# EAGLE schematic Master10 (EAGLE 6.2)
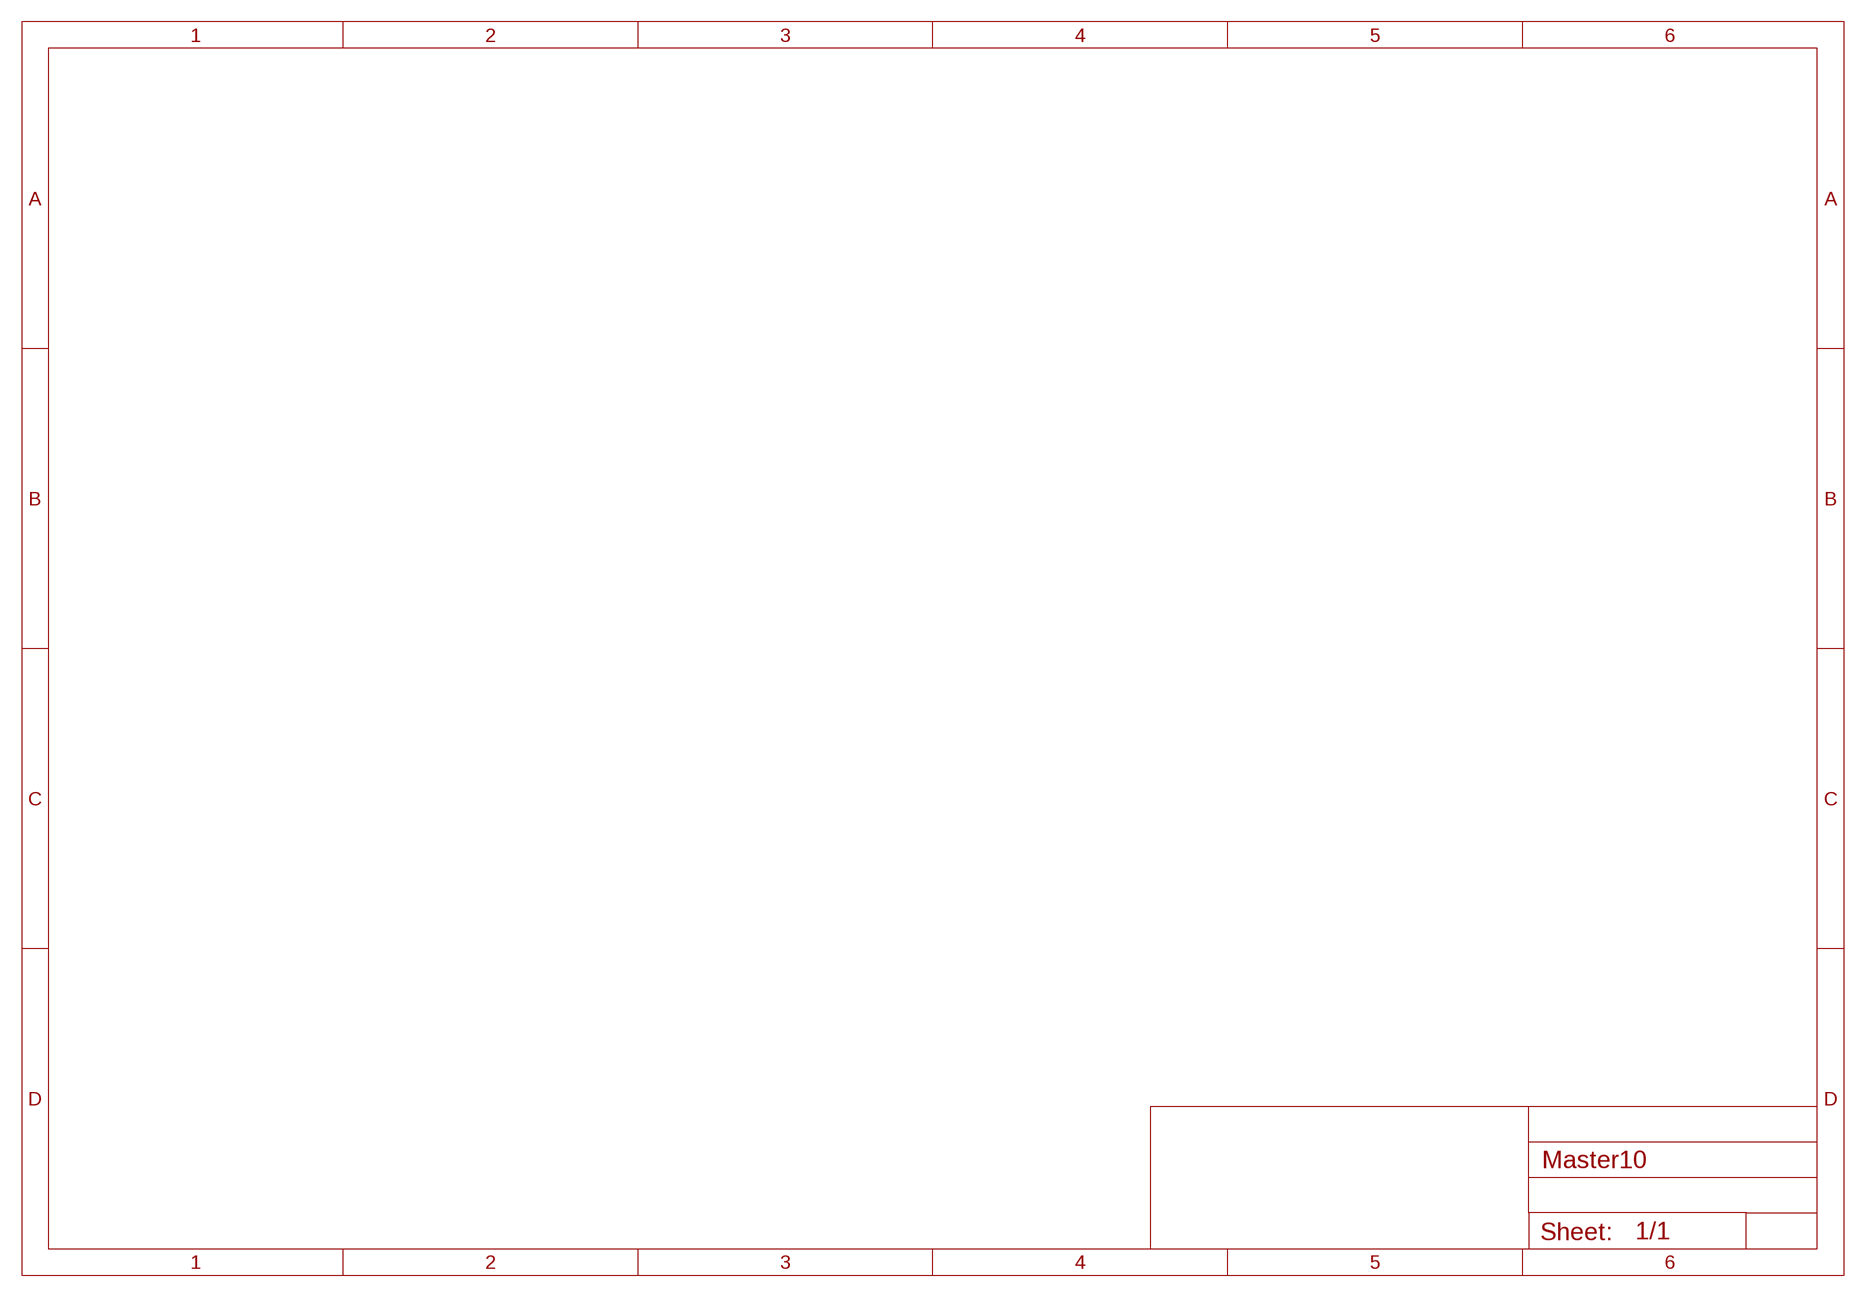
[diagram p0: schematic, sheet 1, part 1 of 2]
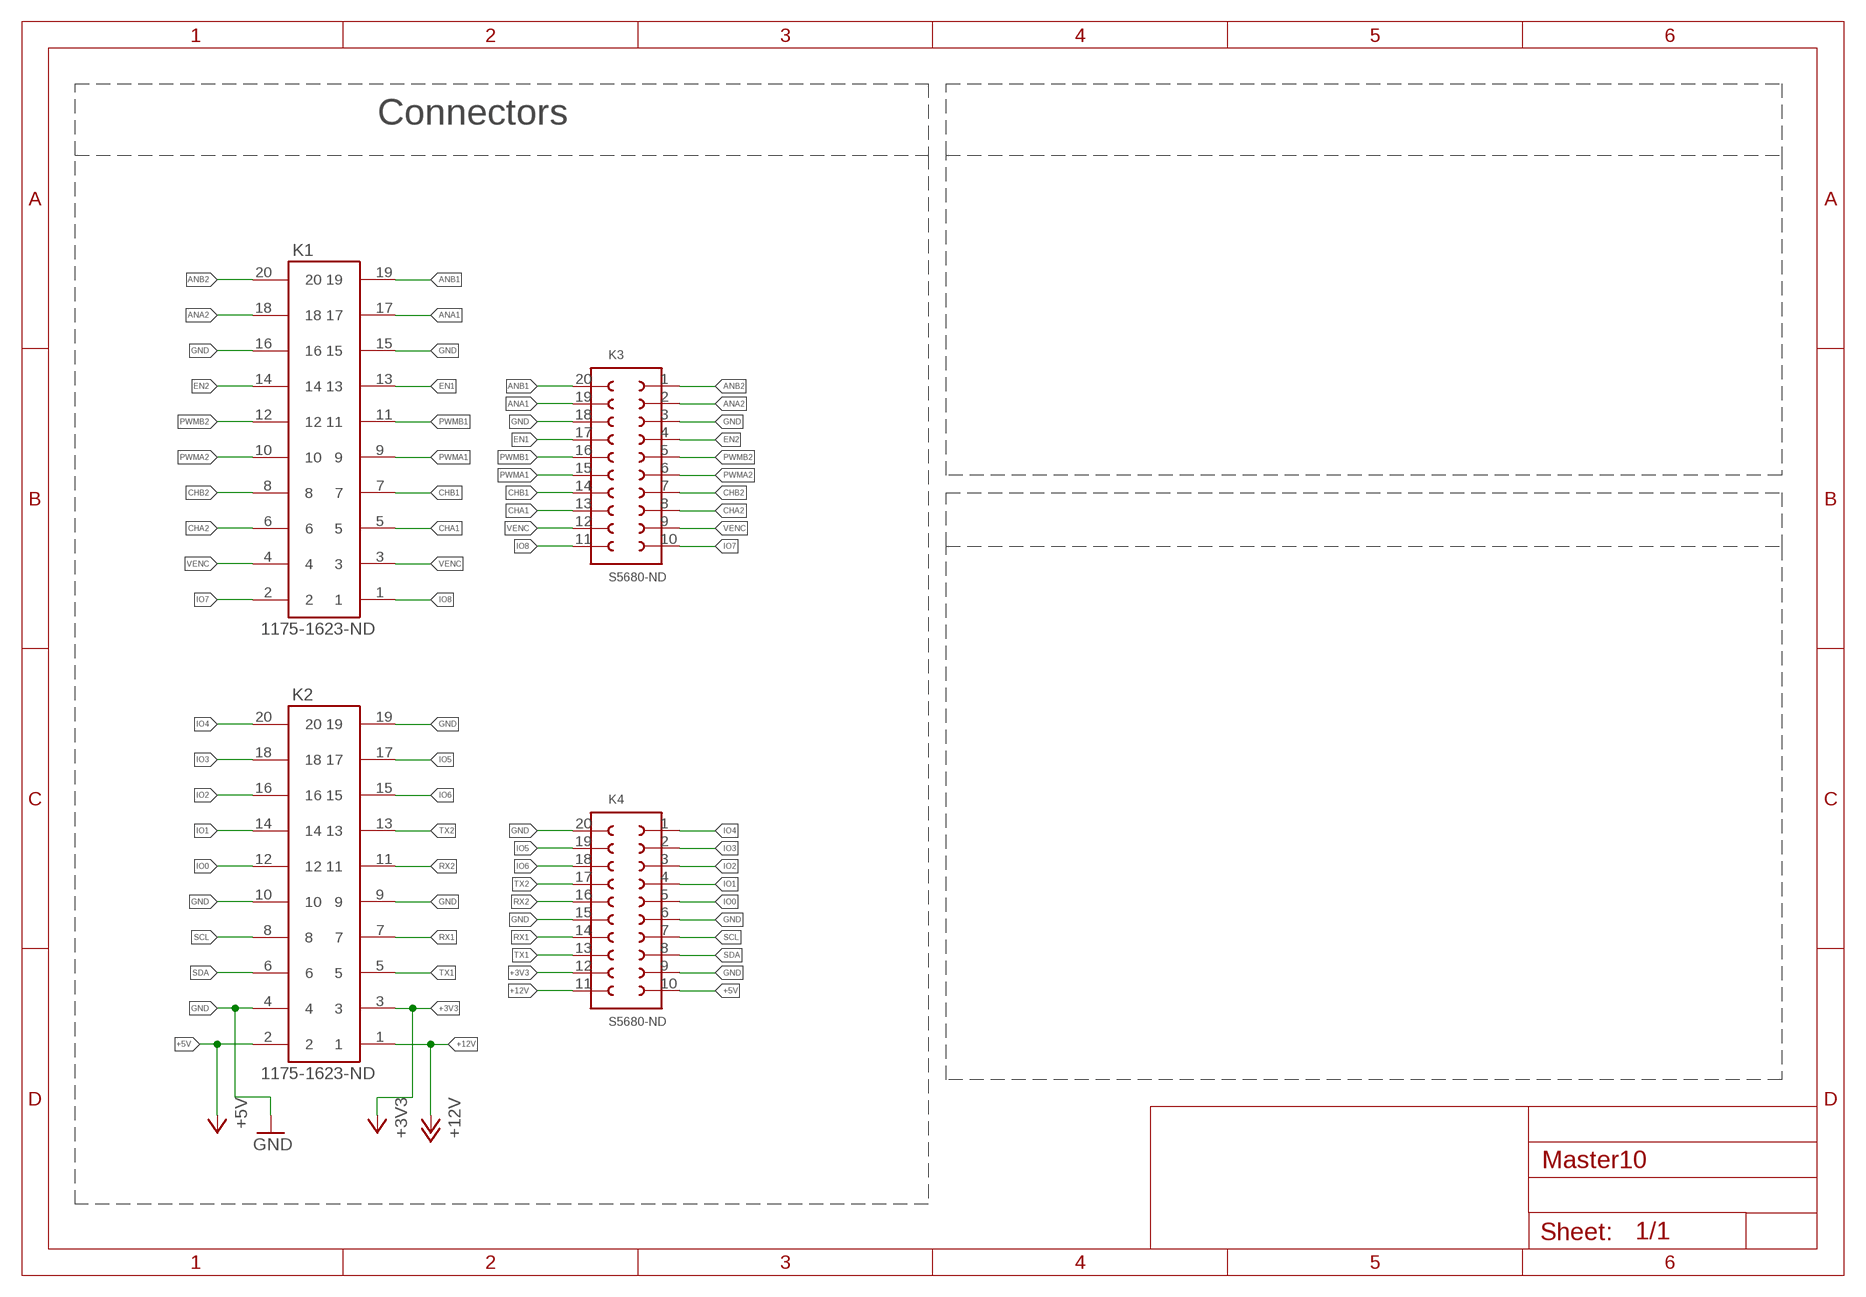
[diagram p1: schematic, sheet 1, part 2 of 2]

## Parts
K1  1175-1623-ND  612X2020621  [612X2020621]
K2  1175-1623-ND  612X2020621  [612X2020621]
K3  S5680-ND  61002021821  [61002021821]
K4  S5680-ND  61002021821  [61002021821]

## Nets
+3V3: K2.3 K4.12
+5V: K2.2 K4.10
+12V: K2.1 K4.11
ANA1: K1.17 K3.19
ANA2: K1.18 K3.2
ANB1: K1.19 K3.20
ANB2: K1.20 K3.1
CHA1: K1.5 K3.13
CHA2: K1.6 K3.8
CHB1: K1.7 K3.14
CHB2: K1.8 K3.7
EN1: K1.13 K3.17
EN2: K1.14 K3.4
GND: K1.15 K1.16 K2.4 K2.9 K2.10 K2.19 K3.3 K3.18 K4.6 K4.9 K4.15 K4.20
IO0: K2.12 K4.5
IO1: K2.14 K4.4
IO2: K2.16 K4.3
IO3: K2.18 K4.2
IO4: K2.20 K4.1
IO5: K2.17 K4.19
IO6: K2.15 K4.18
IO7: K1.2 K3.10
IO8: K1.1 K3.11
PWMA1: K1.9 K3.15
PWMA2: K1.10 K3.6
PWMB1: K1.11 K3.16
PWMB2: K1.12 K3.5
RX1: K2.7 K4.14
RX2: K2.11 K4.16
SCL: K2.8 K4.7
SDA: K2.6 K4.8
TX1: K2.5 K4.13
TX2: K2.13 K4.17
VENC: K1.3 K1.4 K3.9 K3.12

## Notes on the sheet
- Connectors

## Library data of the parts
K1 K2 = Wuerth_Elektronik_eiCan_Wire_to_Board_Connectors:612X2020621: WR-BHD 2.54mm Male SMT Box Header High Temperature, 20 Pins=>Code : Con_WTB_BHD_2.54_Male_SMT_612X2020621 <http://katalog.we-online.de/media/thumbs2/eican/thb_Con_WTB_BHD_2.54_Male_SMT_6120xx20621_pf2.jpg> Details see: http://katalog.we-online.de/en/em/612_0xx_206_21 Created 2014-06-05, Karrer Zheng 2014 (C) Würth Elektronik
K3 K4 = Wuerth_Elektronik_eiCan_Board_to_Board_Connectors:61002021821: WR-PHD 2.54mm Dual SMT Socket Header, 20 Pins=>Code : Con_BTB_SHD_2.54_1_SMT_61002021821 <http://katalog.we-online.de/media/images/eican/Con_BTB_SHD_2.54_1_SMT_6100xx21821_pf2.jpg> Details see: http://katalog.we-online.de/en/em/610_0xx_218_21 Created 2014-05-30, Karrer Zheng 2014 (C) Würth Elektronik

## Net classes
0 default: width 0.203 mm, clearance 0.203 mm
1 power: width 0.305 mm, clearance 0.203 mm